# Altium schematic sheet ElectricSchema.SchDoc
size A4
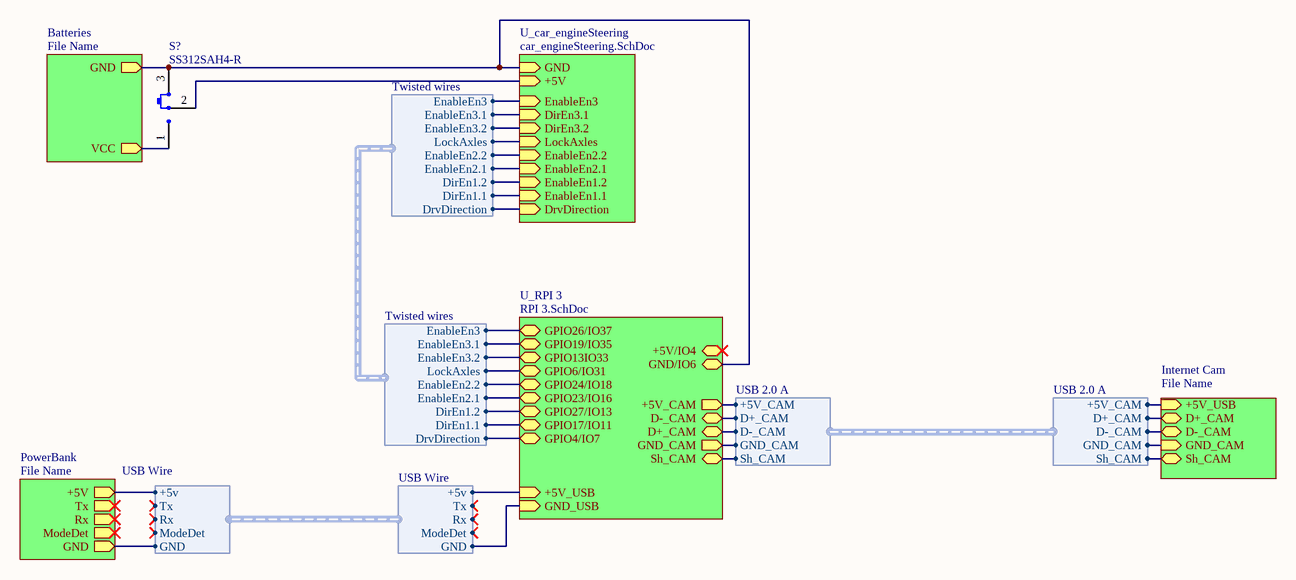
[diagram p0: ElectricSchema.SchDoc]

## Parts
S?  SS312SAH4-R  [NKK SS312SAH4]

## Sub-sheets
Batteries = File Name: VCC (out), GND (out)
Internet Cam = File Name: +5V_USB (in), D+_CAM (bidir), D-_CAM (bidir), GND_CAM (in), Sh_CAM (bidir)
PowerBank = File Name: Rx (out), +5V (out), ModeDet (out), GND (out), Tx (out)
U_car_engineSteering = car_engineSteering.SchDoc: EnableEn1.1 (in), EnableEn1.2 (in), EnableEn2.1 (in), EnableEn2.2 (in), LockAxles (in), DirEn3.1 (in), DirEn3.2 (in), EnableEn3 (in), DrvDirection (in), GND (in), +5V (in)
U_RPI 3 = RPI 3.SchDoc: GPIO4/IO7 (bidir), GPIO17/IO11 (bidir), GPIO27/IO13 (bidir), GPIO26/IO37 (bidir), GPIO13IO33 (bidir), GPIO6/IO31 (bidir), GPIO19/IO35 (bidir), GPIO23/IO16 (bidir), GPIO24/IO18 (bidir), GND/IO6 (bidir), +5V/IO4 (bidir), +5V_USB (in), GND_USB (in), +5V_CAM (out), D-_CAM (bidir), D+_CAM (bidir), GND_CAM (out), Sh_CAM (bidir)

## Harnesses
USB Wire: +5v, Tx, Rx, ModeDet, GND
Twisted wires: EnableEn3, DirEn1.1, DirEn1.2, LockAxles, EnableEn2.2, EnableEn2.1, EnableEn3.2, EnableEn3.1, DrvDirection
USB 2.0 A: +5V_CAM, D+_CAM, D-_CAM, GND_CAM, Sh_CAM

## Nets
NetS?_1: S?.1 ; sheet Batteries/VCC
NetS?_2: S?.2(COM) ; sheet U_car_engineSteering/+5V
NetS?_3: S?.3 ; sheet Batteries/GND, sheet U_car_engineSteering/GND, sheet U_RPI 3/GND/IO6
(unnamed): sheet PowerBank/+5V, sheet U_RPI 3/+5V_USB, harness USB Wire.+5v
(unnamed): sheet PowerBank/GND, sheet U_RPI 3/GND_USB, harness USB Wire.GND
(unnamed): sheet U_car_engineSteering/EnableEn1.1, sheet U_RPI 3/GPIO17/IO11, harness Twisted wires.DirEn1.1
(unnamed): sheet U_car_engineSteering/EnableEn1.2, sheet U_RPI 3/GPIO27/IO13, harness Twisted wires.DirEn1.2
(unnamed): sheet U_car_engineSteering/EnableEn2.1, sheet U_RPI 3/GPIO23/IO16, harness Twisted wires.EnableEn2.1
(unnamed): sheet U_car_engineSteering/EnableEn2.2, sheet U_RPI 3/GPIO24/IO18, harness Twisted wires.EnableEn2.2
(unnamed): sheet U_car_engineSteering/LockAxles, sheet U_RPI 3/GPIO6/IO31, harness Twisted wires.LockAxles
(unnamed): sheet U_car_engineSteering/DirEn3.1, sheet U_RPI 3/GPIO19/IO35, harness Twisted wires.EnableEn3.1
(unnamed): sheet U_car_engineSteering/DirEn3.2, sheet U_RPI 3/GPIO13IO33, harness Twisted wires.EnableEn3.2
(unnamed): sheet U_car_engineSteering/EnableEn3, sheet U_RPI 3/GPIO26/IO37, harness Twisted wires.EnableEn3
(unnamed): sheet U_car_engineSteering/DrvDirection, sheet U_RPI 3/GPIO4/IO7, harness Twisted wires.DrvDirection
(unnamed): sheet U_RPI 3/+5V_CAM, sheet Internet Cam/+5V_USB, harness USB 2.0 A.+5V_CAM
(unnamed): sheet U_RPI 3/D-_CAM, sheet Internet Cam/D+_CAM, harness USB 2.0 A.D+_CAM
(unnamed): sheet U_RPI 3/D+_CAM, sheet Internet Cam/D-_CAM, harness USB 2.0 A.D-_CAM
(unnamed): sheet U_RPI 3/GND_CAM, sheet Internet Cam/GND_CAM, harness USB 2.0 A.GND_CAM
(unnamed): sheet U_RPI 3/Sh_CAM, sheet Internet Cam/Sh_CAM, harness USB 2.0 A.Sh_CAM

## Library data of the parts
S? = SS312SAH4-R: SWITCH SLIDE SPDT 0.4VA 28V; Manufacturer: NKK Switches; Actuator Length: 2.00mm; Actuator Type: Standard; Contact Timing: Shorting (MBB); Current Rating (Amps): 0.4VA (AC/DC); Switch Function: On-On; Part Number: SS312SAH4-R; Circuit: SPDT; ComponentLink1Description: Datasheet; ComponentLink1URL: http://www.nkkswitches.com/pdf/SS3surfaceMount-1.pdf; ComponentLink2Description: DigiKey Link; ComponentLink2URL: http://digikey.com/product-detail/en/nkk-switches/SS312SAH4-R/360-2924-1-ND/1051215; Contact Finish: Gold; Contact Material: Phosphor Bronze; LastUpdated: 04.01.2020 19:10:14; Lifecycle Status: Active; Minimum Order: 1; Mounting Type: Surface Mount, Right Angle; Operating Temperature: -25°C ~ 85°C; Packaging: TapeAndReel; PartId: 1; Part Status: Active; Price: 1.95; Series: SS3; Supplier 1: DigiKey; Supplier Part Number 1: 360-2924-1-ND; Termination Style: Gull Wing; Voltage Rating - AC: 28V; Voltage Rating - DC: 28V